# Altium schematic sheet Voltagemuktiplier.SchDoc
size A4; SheetNumber: 7; SheetTotal: 7
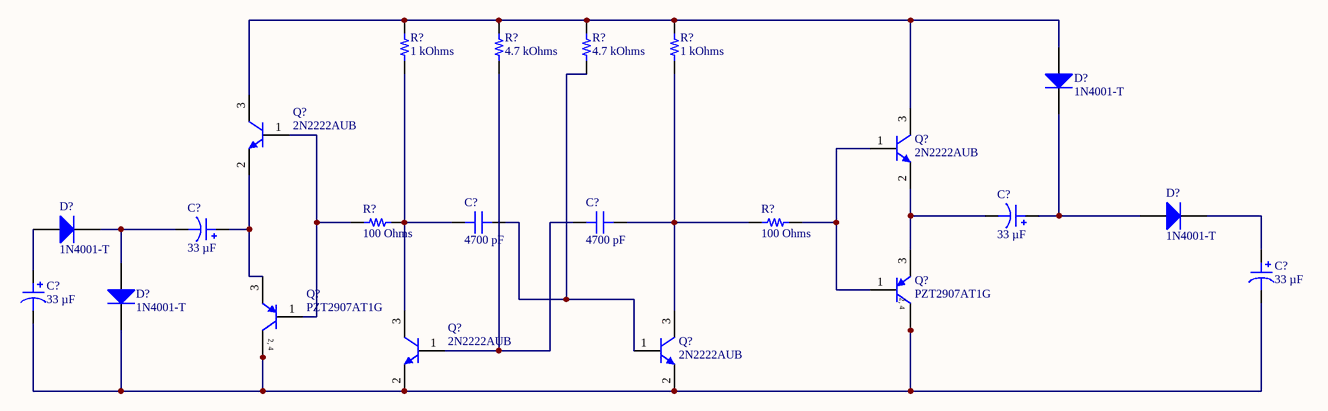
[diagram p0: Voltagemuktiplier.SchDoc]

## Parts
(Parts that share a designator on the sheet are numbered #1, #2 ... from top to bottom, then left to right.)
C?#1  33 µF  [CAP ALSMD 8.3MM H10.5MM]
C?#2  4700 pF  [CAP 0805_2012]
C?#3  4700 pF  [CAP 0805_2012]
C?#4  33 µF  [CAP ALSMD 8.3MM H10.5MM]
C?#5  33 µF  [CAP ALSMD 8.3MM H10.5MM]
C?#6  33 µF  [CAP ALSMD 8.3MM H10.5MM]
D?#1  1N4001-T  [DIOD-DO-41-P-2_V]
D?#2  1N4001-T  [DIOD-DO-41-P-2_V]
D?#3  1N4001-T  [DIOD-DO-41-P-2_V]
D?#4  1N4001-T  [DIOD-DO-41-P-2_V]
Q?#1  2N2222AUB  [MCSM-2N2222AUB-3]
Q?#2  2N2222AUB  [MCSM-2N2222AUB-3]
Q?#3  PZT2907AT1G  [ONSC-SOT-223-4-318E-04_V]
Q?#4  PZT2907AT1G  [ONSC-SOT-223-4-318E-04_V]
Q?#5  2N2222AUB  [MCSM-2N2222AUB-3]
Q?#6  2N2222AUB  [MCSM-2N2222AUB-3]
R?#1  1 kOhms  [RES 0805_2012]
R?#2  4.7 kOhms  [RES 0805_2012]
R?#3  4.7 kOhms  [RES 0805_2012]
R?#4  1 kOhms  [RES 0805_2012]
R?#5  100 Ohms  [RES 0805_2012]
R?#6  100 Ohms  [RES 0805_2012]

## Nets
NetC?#1_1: C?#1.1 D?#1.2(K) D?#2.1(A)
NetC?#1_2: C?#1.2 Q?#2.2(E) Q?#3.3(E)
NetC?#2_1: C?#2.1 Q?#5.3(C) R?#1.1 R?#5.2
NetC?#2_2: C?#2.2 Q?#6.1(B) R?#3.1
NetC?#3_1: C?#3.1 Q?#5.1(B) R?#2.1
NetC?#3_2: C?#3.2 Q?#6.3(C) R?#4.1 R?#6.2
NetC?#4_1: C?#4.1 Q?#1.2(E) Q?#4.3(E)
NetC?#4_2: C?#4.2 D?#3.2(K) D?#4.1(A)
NetC?#5_1: C?#5.1 D?#2.2(K)
NetC?#5_2: C?#5.2 C?#6.2 D?#4.2(K) Q?#3.2(C) Q?#3.4(C) Q?#4.2(C) Q?#4.4(C) Q?#5.2(E) Q?#6.2(E)
NetC?#6_1: C?#6.1 D?#3.1(A)
NetD?#1_1: D?#1.1(A) Q?#1.3(C) Q?#2.3(C) R?#1.2 R?#2.2 R?#3.2 R?#4.2
NetQ?#1_1: Q?#1.1(B) Q?#4.1(B) R?#5.1
NetQ?#2_1: Q?#2.1(B) Q?#3.1(B) R?#6.1

## Notes on the sheet
- (in symbol CMP-1048-00010-1) 2, 4

## Library data of the parts
C?#1 C?#4-C?#6 = EEE-FK1K330P: CAP ALUM 33UF 20% 80V SMD; manufacturer: Panasonic Electronic Components; Impedance: 1.3 Ohms; Lifetime @ Temp.: 2000 Hrs @ 105°C; Polarization: Polar; Ripple Current @ High Frequency: 130 mA @ 100 kHz; Ripple Current @ Low Frequency: 97.5 mA @ 120 Hz; Surface Mount Land Size: 0.327" L x 0.327" W (8.30mm x 8.30mm); Part Number: EEE-FK1K330P; Applications: Automotive; Capacitance: 33 µF; componentlink2description: DigiKey Link; componentlink2url: https://www.digikey.com/en/products/detail/panasonic-electronic-components/EEE-FK1K330P/765998; Device Package: Radial, Can - SMD; Height - Seated (Max): 0.413" (10.50mm); lastupdated: 14-11-2023 21:41:35; Lifecycle Status: Active; Minimum Order: 1; Mounting Type: Surface Mount; Operating Temperature: -55°C ~ 105°C; Package / Case: Radial, Can - SMD; packaging: TapeAndReel; partid: 7604; Part Status: Active; price: 0.21; Ratings: AEC-Q200; series: FK; Size / Dimension: 0.315" Dia (8.00mm); Supplier 1: DigiKey; Supplier Part Number 1: PCE3829CT-ND; Tolerance: ±20%; value: 33 µF; Voltage - Rated: 80 V
C?#2 C?#3 = C0805C472F3GECAUTO7210: CAP CER 0805 4.7NF 25V C0G 1%; manufacturer: KEMET; Temperature Coefficient: C0G, NP0; Part Number: C0805C472F3GECAUTO7210; Value: 4700 pF; Applications: Automotive, ESD Protection; Capacitance: 4700 pF; componentlink1description: Datasheet; componentlink1url: https://connect.kemet.com:7667/gateway/IntelliData-ComponentDocumentation/1.0/download/datasheet/C0805C472F3GECAUTO7210; componentlink2description: DigiKey Link; componentlink2url: https://www.digikey.com/en/products/detail/kemet/C0805C472F3GECAUTO7210/8648690; Device Package: 0805 (2012 Metric); Features: Low ESL; lastupdated: 15-11-2023 20:12:00; Lifecycle Status: Active; Minimum Order: 1; Mounting Type: Surface Mount, MLCC; Operating Temperature: -55°C ~ 125°C; Package / Case: 0805 (2012 Metric); packaging: TapeAndReel; partid: 54380; Part Status: Active; price: 0.30; Ratings: AEC-Q200; series: ESD SMD Auto C0G; Size / Dimension: 0.079" L x 0.049" W (2.00mm x 1.25mm); Supplier 1: DigiKey; Supplier Part Number 1: 399-C0805C472F3GECAUTO7210CT-ND; Thickness (Max): 0.039" (1.00mm); Tolerance: ±1%; Voltage - Rated: 25V
D?#1-D?#4 = CMP-0639-00006-2: 1.0 A Rectifier, 15 pF, 50 V, -65 to 150 degC, 2-Pin DO-41 Plastic, RoHS, Tape and Reel; Manufacturer: Diodes Inc; VF (V): 1; CT (pF): 15; Max. IR (uA): 5; VRRM (V): 50; Max. IFSM (A): 30; RoHS: TRUE; Mounting Technology: Through Hole; PartNumber: 1N4001-T; ComponentLink2Description: Datasheet; DatasheetVersion: Rev. 8-2; Operating Temperature Range (degC): -65 to 150; Packing: Tape and Reel; PackageReference: DO-41-P-2; ComponentLink1URL: http://diodes.com/; PackageDescription: 2-Pin Axial Lead, Body 4.635 x 2.36 mm, Lead Spread 25.4 mm; ComponentLink2URL: http://diodes.com/datasheets/ds28002.pdf; Max. Average Rectified Current IO (A): 1; ComponentLink1Description: Manufacturer URL
Q?#1 Q?#2 Q?#5 Q?#6 = CMP-2000-07613-1: NPN Transistor, 50 V, 0.8 A, -65 to 200 degC, 3-Pin SMD, Tray; Manufacturer: Microsemi; Maximum Collector Base Voltage: 75V; Maximum Power Dissipation: 500mW; Maximum Collector Emitter Voltage: 50V; Maximum DC Collector Current: 0.8A; Minimum DC Current Gain: 50@0.1mA@10V; Maximum Collector Emitter Saturation Voltage: 0.3@15mA@150mA; Rad Hard: No; Type: NPN; Package Description: 3-Pin Surface Mount Device, Body 3.085 x 2.45 mm, Pitch 0.955 mm; Operating Temperature: -65to200°C; Manufacturer URL: http://www.microsemi.com/; Packaging: WafflePack; Package Reference: 2N2222AUB; Datasheet Version: Rev. 2, 03/2010; Datasheet URL: http://datasheet.octopart.com/2N2222AUB-Microsemi-datasheet-11765791.pdf; Pin Count: 3; Category: GPBJT; Mounting: SurfaceMount; Package: 3UB
Q?#3 Q?#4 = CMP-1048-00010-1: PNP Silicon Epitaxial Transistor, 4-Pin SOT-223, Pb-Free, Tape and Reel; Manufacturer: On Semiconductor; fT Min (MHz): 200; IC Continuous (A): -0.6; RoHS: TRUE; ComponentLink2URL: http://www.onsemi.com/pub_link/Collateral/PZT2907AT1-D.PDF; ComponentLink1Description: Manufacturer URL; Mounting Technology: Surface Mount; Polarity: PNP; PackageVersion: Rev. N, 08/2009; ComponentLink3URL: http://www.onsemi.com/pub_link/Collateral/318E-04.PDF; ComponentLink1URL: http://www.onsemi.com/; Packing: Tape and Reel; DatasheetVersion: Rev. 10; ComponentLink2Description: Datasheet; PackageReference: SOT-223-4-318E-04; ComponentLink3Description: Package Specification; PackageDescription: 4-Pin Small Outline Transistor, Body 6.5 x 3.5 mm, Pitch 2.3 mm; PartNumber: PZT2907AT1G
R?#1 R?#4-R?#6 = AC0805FR-074K7L: RES SMD 4.7K OHM 1% 1/8W 0805; Manufacturer: Yageo; Power (Watts): 0.125W, 1/8W; Resistance: 4.7 kOhms; Temperature Coefficient: ±100ppm/°C; Part Number: AC0805FR-074K7L; ComponentLink1Description: Datasheet; ComponentLink1URL: https://www.yageo.com/upload/media/product/productsearch/datasheet/rchip/PYu-AC_51_RoHS_L_7.pdf; ComponentLink2Description: DigiKey Link; ComponentLink2URL: https://www.digikey.com/en/products/detail/yageo/AC0805FR-074K7L/5896876; Composition: Thick Film; Device Package: 0805 (2012 Metric); Features: Automotive AEC-Q200, Moisture Resistant; Height - Seated (Max): 0.024" (0.60mm); LastUpdated: 14-11-2023 20:58:50; Lifecycle Status: Active; Minimum Order: 1; Number of Terminations: 2; Operating Temperature: -55°C ~ 155°C; Package / Case: 0805 (2012 Metric); Packaging: TapeAndReel; PartId: 34661; Part Status: Active; Price: 0.01; Ratings: AEC-Q200; Series: AC; Size / Dimension: 0.079" L x 0.049" W (2.00mm x 1.25mm); Supplier 1: DigiKey; Supplier Part Number 1: YAG3738CT-ND; Supplier Device Package: 0805; Tolerance: ±1%
  R?#1 R?#4: Value: 1 kOhms
  R?#5 R?#6: Value: 100 Ohms
R?#2 R?#3 = AC0805FR-074K7L: RES SMD 4.7K OHM 1% 1/8W 0805; Manufacturer: Yageo; Power (Watts): 0.125W, 1/8W; Temperature Coefficient: ±100ppm/°C; Part Number: AC0805FR-074K7L; Value: 4.7 kOhms; ComponentLink1Description: Datasheet; ComponentLink1URL: https://www.yageo.com/upload/media/product/productsearch/datasheet/rchip/PYu-AC_51_RoHS_L_7.pdf; ComponentLink2Description: DigiKey Link; ComponentLink2URL: https://www.digikey.com/en/products/detail/yageo/AC0805FR-074K7L/5896876; Composition: Thick Film; Device Package: 0805 (2012 Metric); Features: Automotive AEC-Q200, Moisture Resistant; Height - Seated (Max): 0.024" (0.60mm); LastUpdated: 14-11-2023 20:58:50; Lifecycle Status: Active; Minimum Order: 1; Number of Terminations: 2; Operating Temperature: -55°C ~ 155°C; Package / Case: 0805 (2012 Metric); Packaging: TapeAndReel; PartId: 34661; Part Status: Active; Price: 0.01; Ratings: AEC-Q200; Resistance: 4.7 kOhms; Series: AC; Size / Dimension: 0.079" L x 0.049" W (2.00mm x 1.25mm); Supplier 1: DigiKey; Supplier Part Number 1: YAG3738CT-ND; Supplier Device Package: 0805; Tolerance: ±1%